# EAGLE design Kitty_Cannon_Schematic (EAGLE 9.6.2)
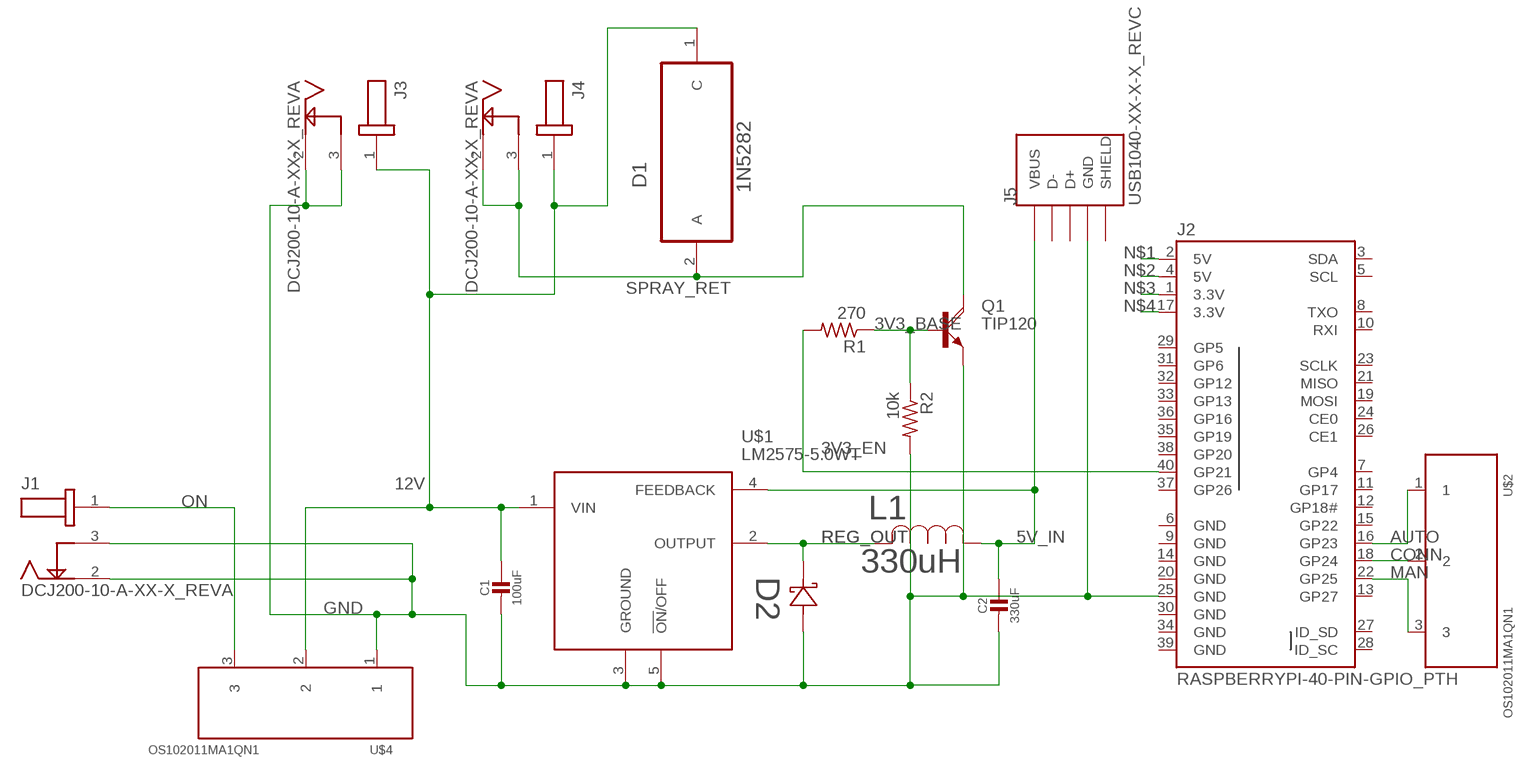
[diagram p0: schematic, sheet 1]

## Parts
C1  100uF  860010372006_100UF  [860010372006_100UF]
C2  330uF  860010372006_100UF  [860010372006_100UF]
D1  1N5282  [DIO_1N5282]
D2  SB3100E-G  [SB2E-G]
J1  DCJ200-10-A-XX-X_REVA  [GCT_DCJ200-10-A-XX-X_REVA]
J2  RASPBERRYPI-40-PIN-GPIO_PTH  [2X20_SHROUDED]
J3  DCJ200-10-A-XX-X_REVA  [GCT_DCJ200-10-A-XX-X_REVA]
J4  DCJ200-10-A-XX-X_REVA  [GCT_DCJ200-10-A-XX-X_REVA]
J5  USB1040-XX-X-X_REVC  [GCT_USB1040-XX-X-X_REVC]
L1  330uH  1433428C  [1433428C_MUR]
Q1  TIP120  [TO220AH]
R1  270  R-US_0204/5  [0204/5]
R2  10k  R-US_0204/5  [0204/5]
U$1  LM2575-5.0WT  [LM2575-5.0WT]
U$2  OS102011MA1QN1  [OS102011MA1QN1]
U$4  OS102011MA1QN1  [OS102011MA1QN1]

## Nets
3V3_BASE: Q1.B R1.1 R2.1
3V3_EN: J2.40(GP21) R1.2
5V_IN: C2.1 J5.1(VBUS) L1.1 U$1.4(FEEDBACK)
12V: C1.1 D1.1(C) J3.1 J4.1 U$1.1(VIN) U$4.2
AUTO: J2.16(GP23) U$2.1
CONN: J2.18(GP24) U$2.2
GND: C1.2 C2.2 D2.2 J1.2 J1.3 J2.25(GND) J3.2 J3.3 J5.4(GND) Q1.E R2.2 U$1.3(GROUND) U$1.5(!ON!/OFF) U$4.1
MAN: J2.22(GP25) U$2.3
N$1: J2.2(5V)
N$2: J2.4(5V)
N$3: J2.1(3.3V)
N$4: J2.17(3.3V)
ON: J1.1 U$4.3
REG_OUT: D2.1 L1.2 U$1.2(OUTPUT)
SPRAY_RET: D1.2(A) J4.2 J4.3 Q1.C
Unconnected: J2.3(SDA) J2.5(SCL) J2.7(GP4) J2.8(TXO) J2.10(RXI) J2.11(GP17) J2.12(GP18#) J2.13(GP27) J2.15(GP22) J2.19(MOSI) J2.21(MISO) J2.23(SCLK) J2.24(CE0) J2.26(CE1) J2.27(ID_SD) J2.28(ID_SC) J2.29(GP5) J2.31(GP6) J2.32(GP12) J2.33(GP13) J2.35(GP19) J2.36(GP16) J2.37(GP26) J2.38(GP20) J5.2(D-) J5.3(D+)

## Power pins joined to a net without a drawn wire
GND: J2.6(GND) J2.9(GND) J2.14(GND) J2.20(GND) J2.30(GND) J2.34(GND) J2.39(GND)
SHIELD: J5.5(SHIELD) J5.6(SHIELD)

## Library data of the parts
C1 C2 = 860010372006_100uF:860010372006_100UF
D1 = 1N5282:1N5282: Small Signal Diode Check prices <https://pricing.snapeda.com/parts/1N5282/ON/view-part?ref=eda>; AVAILABILITY: In Stock; DESCRIPTION: 1N5282 Series 200 mA 80 V 500 mW Through Hole Small Signal Diode - DO-35; MF: ON; MP: 1N5282; PACKAGE: DO-35 NXP Semiconductors; PRICE: None; PURCHASE-URL: https://pricing.snapeda.com/search/part/1N5282/?ref=eda
D2 = SB3100E-G_Schottky:SB3100E-G; COPYRIGHT: Copyright (C) 2021 Ultra Librarian. All rights reserved.; MANUFACTURER_PART_NUMBER: SB3100E-G; MFR_NAME: Comchip
J1 J3 J4 = DCJ200-10-A-XX-X_REVA:DCJ200-10-A-XX-X_REVA: DC Power Jack, Thru-Hole, Horizontal, with Locating Pegs, D2.0mm Check prices <https://pricing.snapeda.com/parts/DCJ200-10-A-K1-K/Global%20Connector%20Technology/view-part?ref=eda>; AVAILABILITY: In Stock; DESCRIPTION: Power Barrel Connector Jack 2.05mm ID (0.081), 5.50mm OD (0.217) Through Hole, Right Angle; MF: Global Connector Technology; MP: DCJ200-10-A-K1-K; PACKAGE: None; PRICE: None; PURCHASE-URL: https://pricing.snapeda.com/search/part/DCJ200-10-A-K1-K/?ref=eda
J2 = SparkFun-Connectors:RASPBERRYPI-40-PIN-GPIO: Raspberry Pi GPIO Header 2x20 pin connector, as found on B, B+, A+ models. Both shrouded PTH and SMT versions available. SparkFun Products: GPIO Shrouded Header <https://www.sparkfun.com/products/13054>- PTH SparkFun Pi Wedge (Preassembled) <https://www.sparkfun.com/products/13717>; PROD_ID: CONN-12263; SF_ID: PRT-13054
J5 = USB1040-XX-X-X_REVC:USB1040-XX-X-X_REVC: USB RECEPTACLE, TYPE A, 4 PIN, THROUGH HOLE, VERTICAL, WITH KINKED SHELL STAKES Check prices <https://pricing.snapeda.com/parts/USB1040-GF-L-B/Global%20Connector%20Technology/view-part?ref=eda>; AVAILABILITY: In Stock; DESCRIPTION: USB-A (USB TYPE-A) USB 2.0 Receptacle Connector 4 Position Through Hole; MF: Global Connector Technology; MP: USB1040-GF-L-B; PACKAGE: None; PRICE: None; PURCHASE-URL: https://pricing.snapeda.com/search/part/USB1040-GF-L-B/?ref=eda
L1 = 1433428C_330uH:1433428C; COPYRIGHT: Copyright (C) 2021 Ultra Librarian. All rights reserved.; MANUFACTURER_PART_NUMBER: 1433428C; MFR_NAME: Murata
Q1 = transistor-power:TIP120: NPN DARLINGTON TRANSISTOR
R1 R2 = rcl:R-US_: RESISTOR, American symbol; SPICEPREFIX: R
U$1 = LM2575-5.0WT:LM2575-5.0WT
U$2 U$4 = C&K:OS102011MA1QN1

## Module EA2-3NJ
Ports: 

### Library data of the parts

## Board
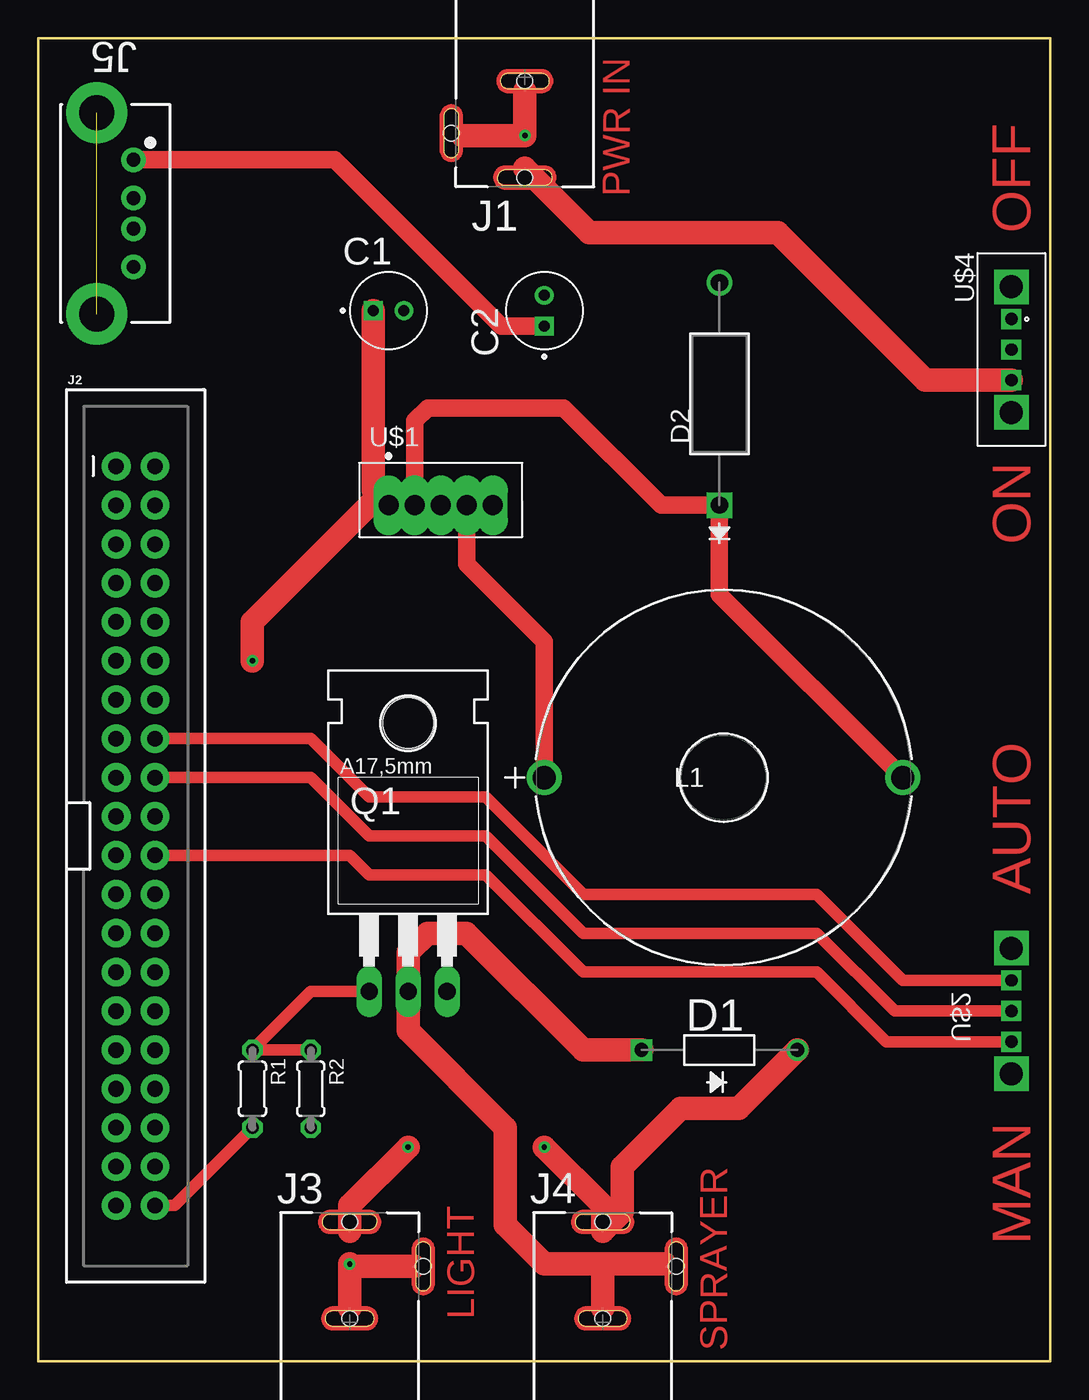
[diagram p1: board, top side]
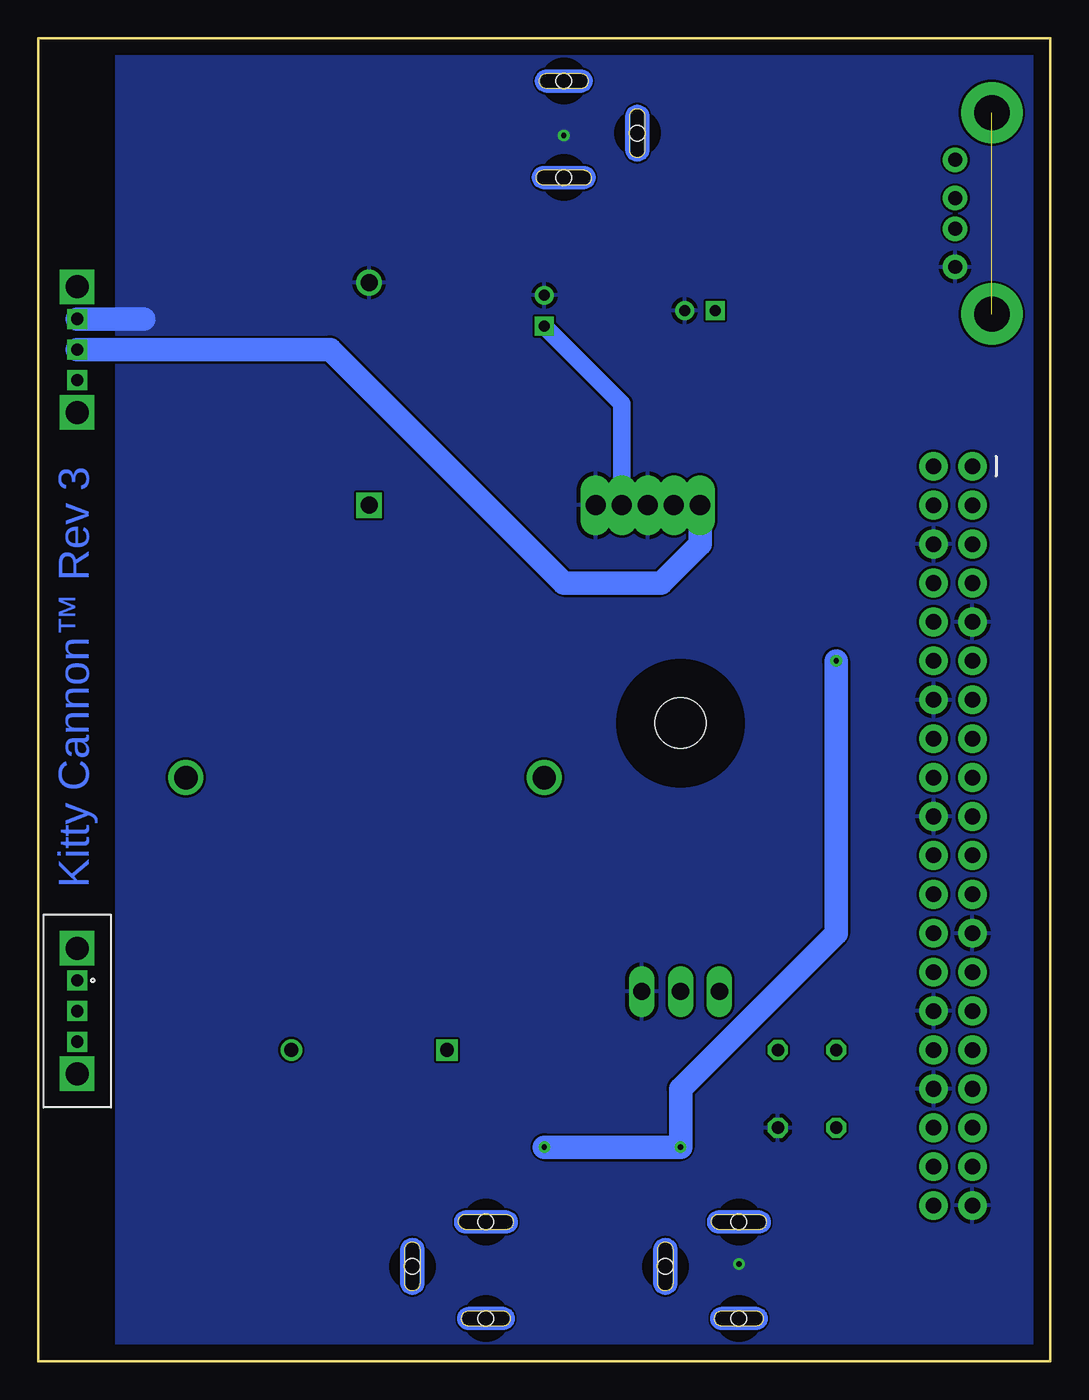
[diagram p2: board, bottom side, seen from below]

Size 66.04 x 86.36 mm. Coordinates in mm from the lower left corner, seen from the top.
Outline: 0,86.03 0,0
Outline: 0,0 0,86.36 66.04,86.36 66.04,0 0,0
Copper layers (1*16): Top 0.035mm / dielectric 1.5mm / Bottom 0.035mm
Design rules "default": minimum track width 6mil, minimum drill 0.35mm, track to track 6mil, track to pad 6mil, pad to pad 6mil, via to via 6mil, smd to smd 6mil, copper to edge 40mil, drill to drill 6mil, minimum pad ring 10mil, minimum via ring 8mil, stop-mask expansion 4mil, vias tented up to drill 0mil, thermal gap 10mil

### Footprints (pad centres in the part's own frame; a part is rotated, then mirrored left to right if it is on the bottom)
860010372006_100UF = drill 0.72 pad 1.12 square: 1 -1,0 | drill 0.72 pad 1.12: 2 1,0
DIO_1N5282 = drill 0.889: 1 -10.16,0 | drill 0.889 square: 2 0,0
SB2E-G = drill 1.118 pad 1.626 square: 1 0,0 | drill 1.118 pad 1.626: 2 14.529,0
GCT_DCJ200-10-A-XX-X_REVA = smd 0.1 x 0.1: 1 0,5.95; 2 0,0.9; 3 4.2,3.65 | hole 1: 0,0.25; 4.8,3.65; 0,6.55
2X20_SHROUDED = drill 1.016 pad 1.88: 1 -1.27,24.13; 2 1.27,24.13; 3 -1.27,21.59; 4 1.27,21.59; 5 -1.27,19.05; 6 1.27,19.05; 7 -1.27,16.51; 8 1.27,16.51; 9 -1.27,13.97; 10 1.27,13.97; 11 -1.27,11.43; 12 1.27,11.43; 13 -1.27,8.89; 14 1.27,8.89; 15 -1.27,6.35; 16 1.27,6.35; 17 -1.27,3.81; 18 1.27,3.81; 19 -1.27,1.27; 20 1.27,1.27; 21 -1.27,-1.27; 22 1.27,-1.27; 23 -1.27,-3.81; 24 1.27,-3.81; 25 -1.27,-6.35; 26 1.27,-6.35; 27 -1.27,-8.89; 28 1.27,-8.89; 29 -1.27,-11.43; 30 1.27,-11.43; 31 -1.27,-13.97; 32 1.27,-13.97; 33 -1.27,-16.51; 34 1.27,-16.51; 35 -1.27,-19.05; 36 1.27,-19.05; 37 -1.27,-21.59; 38 1.27,-21.59; 39 -1.27,-24.13; 40 1.27,-24.13
GCT_USB1040-XX-X-X_REVC = drill 0.9 pad 1.6: 1 -3.5,2.4; 2 -1,2.4; 3 1,2.4; 4 3.5,2.4 | drill 2.3 pad 4: 5 -6.57,0; 6 6.57,0
1433428C_MUR = drill 1.524 pad 2.032: 1 0,0; 2 23.393,0
TO220AH = drill 1.118 long: B -2.54,-6.35; C 0,-6.35; E 2.54,-6.35 | hole 3.302: 0,11.176
0204/5 = drill 0.813 octagon: 1 -2.54,0; 2 2.54,0
LM2575-5.0WT = drill 1.31 pad 1.27 long: 1 -6.35,1.27; 2 -4.648,1.27; 3 -2.946,1.27; 4 -1.244,1.27; 5 0.458,1.27
OS102011MA1QN1 = drill 0.8 square: 1 -2,0; 2 0,0; 3 2,0 | drill 1.5 square: 4 -4.1,0; 5 4.1,0

### Placement (x,y rotation side)
C1  22.86,68.58 0 top
C2  33.02,68.58 90 top
D1  39.37,20.32 180 top
D2  44.45,55.88 90 top
J1  31.75,83.82 180 top
J2  6.35,34.29 0 top
J3  20.32,2.54 0 top
J4  36.83,2.54 0 top
J5  3.81,74.93 270 top
L1  33.02,38.1 0 top
Q1  24.13,30.48 0 top
R1  13.97,17.78 270 top
R2  17.78,17.78 270 top
U$1  29.21,54.61 0 top
U$2  63.5,22.86 270 bottom
U$4  63.5,66.04 270 top

### Tracks (layer width: path | path; a pad name or v marks a point on that pad's centre or on a via)
3V3_BASE
  Top 0.762: Q1.B 17.78,24.13 R1.1 R2.1
3V3_EN
  Top 0.762: R1.2 8.89,10.16 J2.40
5V_IN
  Top 1.143: L1.1 33.02,46.99 27.97,52.04 U$1.4 | J5.1 19.36,78.43 30.21,67.58 C2.1
  Bottom 1.143: C2.1 27.97,62.53 U$1.4
12V  (via drill 0.35)
  Top 1.524: v33.02,13.97 36.83,10.16 J4.1 38.1,9.76 38.1,12.7 41.91,16.51 45.72,16.51 D1.1 | J3.1 20.32,10.16 v24.13,13.97 | C1.1 21.86,56.88 U$1.1 21.59,55.88 13.97,48.26 v13.97,45.72
  Bottom 1.524: v33.02,13.97 v24.13,13.97 24.13,17.78 13.97,27.94 v13.97,45.72 | U$4.2 46.99,66.04 31.75,50.8 25.4,50.8 22.86,53.34 U$1.1
AUTO
  Top 0.762: J2.16 15.24,40.64 17.78,40.64 21.59,36.83 29.21,36.83 35.56,30.48 50.8,30.48 56.42,24.86 U$2.1
CONN
  Top 0.762: J2.18 15.24,38.1 17.78,38.1 21.59,34.29 29.21,34.29 35.56,27.94 50.8,27.94 55.88,22.86 U$2.2
GND  (via drill 0.35)
  Top 0.152: 20.48,6.19 v20.32,6.35
  Top 0.406: J1.3 27.71,80.01
  Top 1.524: J1.2 v31.75,80.01 27.71,80.01 | v20.32,6.35 J3.2 | J3.3 20.48,6.19
  Bottom 1.524: U$4.1 59.15,68.04
  pour Bottom: 0,86.36 60.96,86.36 60.96,0 0,0
MAN
  Top 0.762: J2.22 17.78,33.02 20.32,33.02 21.59,31.75 29.21,31.75 35.56,25.4 50.8,25.4 55.34,20.86 U$2.3
ON
  Top 1.524: U$4.3 57.88,64.04 48.26,73.66 35.96,73.66 J1.1
REG_OUT
  Top 1.143: L1.2 44.45,50.06 D2.1 40.64,55.88 34.29,62.23 25.4,62.23 24.56,61.39 U$1.2
SHIELD  (1 unrouted)
SPRAY_RET
  Top 0.152: J4.3 40.87,6.35
  Top 1.524: J4.2 36.83,6.35 | 40.87,6.35 36.83,6.35 | 36.83,6.35 33.02,6.35 30.48,8.89 30.48,15.24 24.13,21.59 Q1.C 24.13,26.67 25.4,27.94 27.94,27.94 35.56,20.32 D1.2

### Text on the board
Top: PWR IN | OFF | ON | AUTO | SPRAYER | LIGHT | MAN
Bottom: Kitty Cannon™ Rev 3